# Altium project FT232RL.PRJPCB
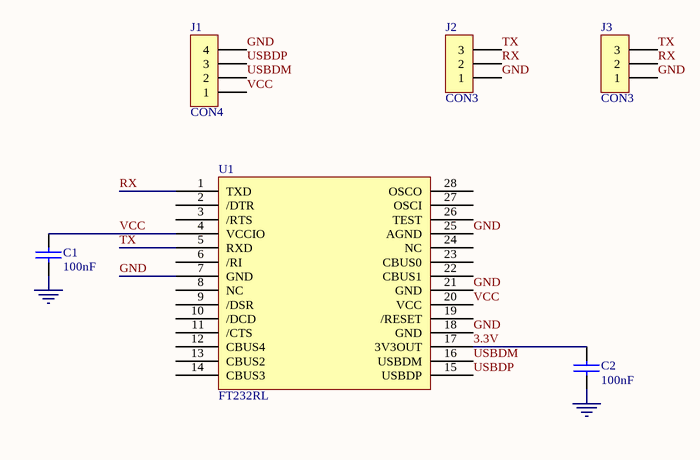
[diagram p0: FT232RL.SCHDOC]
1 sheet, 6 parts. Net scope: global (net labels, ports and power ports of the same name join across sheets).
Board file: FT232RL.PCBDOC

## Sheet FT232RL.SCHDOC
size B

### Parts
C1  100nF  [0603]
C2  100nF  [0603]
J1  CON4  [USB A MALE 2]
J2  CON3  [SIP3]
J3  CON3  [SIP3]
U1  FT232RL  [SSOP-28]

### Nets
GND: C1.2 C2.2 J1.4 J2.1 J3.1 U1.7(GND) U1.18(GND) U1.21(GND) U1.25(AGND)
3.3V: C2.1 U1.17(3V3OUT)
RX: J2.2 J3.2 U1.1(TXD)
TX: J2.3 J3.3 U1.5(RXD)
USBDM: J1.2 U1.16(USBDM)
USBDP: J1.3 U1.15(USBDP)
VCC: C1.1 J1.1 U1.4(VCCIO) U1.20(VCC)

Not connected (* = marked no-connect by the designer): U1 2(/DTR) 3(/RTS) 6(/RI) 8(NC) 9(/DSR) 10(/DCD) 11(/CTS) 12(CBUS4) 13(CBUS2) 14(CBUS3) 19(/RESET) 22(CBUS1) 23(CBUS0) 24(NC) 26(TEST) 27(OSCI) 28(OSCO)

### Library data of the parts
C1 C2 = CAP: Capacitor
J1 = CON4: Connector
J2 J3 = CON3: Connector